# Altium project Controller.PrjPcb (part 1 of 2)
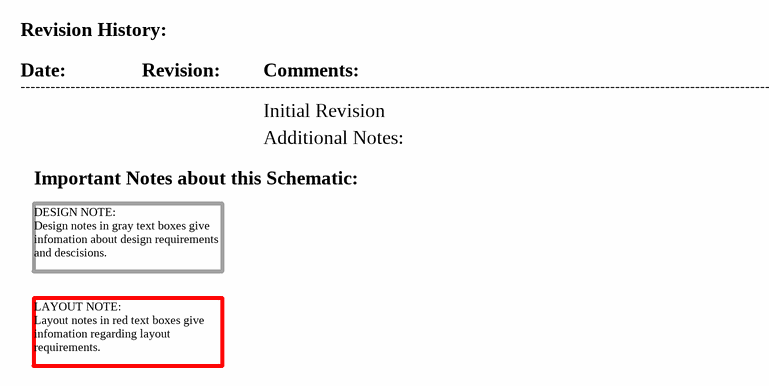
[diagram p0: 01-Revision_History_and_Contents.SchDoc]
8 sheets, 159 parts. Net scope: global (net labels, ports and power ports of the same name join across sheets).
Board file: Controller.PcbDoc
Sheets:
  01-Revision_History_and_Contents.SchDoc
  02_USB_Bridge.SchDoc
  03_Connectors.SchDoc
  04_PSoC6.SchDoc
  05_Mechanical.SchDoc
  06_Power.SchDoc
  07_Programming_Reset.SchDoc
  08_User_IO.SchDoc

## Sheet 01-Revision_History_and_Contents.SchDoc: Revision History and Table of Contents
size A; Revision: A; SheetNumber: 1; SheetTotal: 8; ECE315_Project_Name: ECE453 MCU Base Project

### Notes on the sheet
- Revision History:
- Date:
- ----------------------------------------------------------------------------------------------------------------------------------------------------------------------
- Revision:
- Comments:
- Initial Revision
- Important Notes about this Schematic:
- Additional Notes:
- DESIGN NOTE:
  Design notes in gray text boxes give infomation about design requirements and descisions.
- LAYOUT NOTE:
  Layout notes in red text boxes give infomation regarding layout requirements.
- Title:
- Size:
- A
- Project
- Rev:
- Sheet:
- of
- College of Engineering
- 1415 Engineering Drive
- Madison, WI 53706

## Sheet 02_USB_Bridge.SchDoc: USB Bridge
size A; Revision: A; SheetNumber: 2; SheetTotal: 8; ECE315_Project_Name: ECE453 MCU Base Project
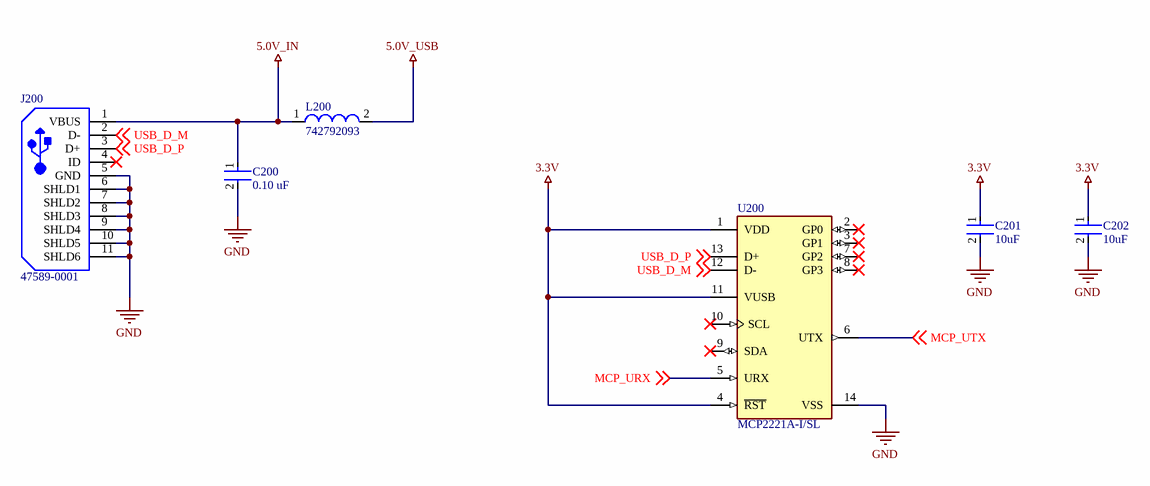
[diagram p1: 02_USB_Bridge.SchDoc]

### Parts
C200  0.10 uF  [FP-C0805C-DN-MFG]
C201  10uF  [FP-C0805C-DG-MFG]
C202  10uF  [FP-C0805C-DG-MFG]
J200  47589-0001  [MOLX-47589-0001_V]
L200  742792093  [SMD-0805]
U200  MCP2221A-I/SL  [FP-C04-065-SL-MFG]

### Nets
3.3V: C201.1 C202.1 U200.1(VDD) U200.4(~{RST}) U200.11(VUSB)
5.0V_IN: C200.1 J200.1(VBUS) L200.1
5.0V_USB: L200.2
GND: C200.2 C201.2 C202.2 J200.5(GND) J200.6(SHLD1) J200.7(SHLD2) J200.8(SHLD3) J200.9(SHLD4) J200.10(SHLD5) J200.11(SHLD6) U200.14(VSS)
MCP_URX: U200.5(URX) ; off-sheet MCP_URX
MCP_UTX: U200.6(UTX) ; off-sheet MCP_UTX
USB_D_M: J200.2(D-) U200.12(D-) ; off-sheet USB_D_M
USB_D_P: J200.3(D+) U200.13(D+) ; off-sheet USB_D_P

Not connected (* = marked no-connect by the designer): J200 4(ID)*; U200 2(GP0)* 3(GP1)* 7(GP2)* 8(GP3)* 9(SDA)* 10(SCL)*

### Notes on the sheet
- Title:
- Size:
- A
- Project
- Rev:
- Sheet:
- of
- College of Engineering
- 1415 Engineering Drive
- Madison, WI 53706

### Library data of the parts
C200 = CMP-2007-00279-2: CAP CER 0.1UF 50V X7R 0805; Manufacturer Part Number: C0805C104K5RACTU; Manufacturer: KEMET; Value: 0.10 μF; Tolerance: 0.1; Temperature Coefficient: 30ppm/°C; Material: Ceramic; Device Class L2: Capacitors; Temperature Range Low: -55°C; Voltage Rating: 50 V; Digikey Description: CAP CER 0.1UF 50V X7R 0805; Category: Cap; ComponentLink2Description: Datasheet; Octopart: https://octopart.com/c0805c104k5ractu-kemet-143926; RoHS: TRUE; ComponentLink2URL: https://content.kemet.com/datasheets/KEM_C1003_C0G_SMD.pdf; Temperature Characteristic: X7R; Temperature: -55°C to +125°C; Height: 0.88mm; Temperature Range High: +125°C; Device Class L1: Passive Components; Automotive: No; Lead Free: Yes; Ipc Land Pattern Name: CAPC200125X78; Device Class L3: Ceramic Capacitors; Mouser Description: Cap Ceramic 0.1uF 50V X7R 10% SMD 2.0 x 1.2 mm 125 C Paper T/R; Capacitance: 0.10 μF; Package: C0805C-DN
C201 C202 = CMP-2007-03243-2: CAP CER 10UF 10V X5R 0805; Manufacturer Part Number: C0805C106K8PACTU; Manufacturer: Kemet; 3DS Part Number: 220-00001; Tolerance: 10%; Temperature Coefficient: 15%; Material: Ceramic; Device Class L2: Capacitors; Device Class L1: Passive Components; ComponentLink2URL: https://content.kemet.com/datasheets/KEM_C1006_X5R_SMD.pdf; Height: 1.4mm; Lead Free: Yes; Digikey Description: CAP CER 10UF 10V X5R 0805; Octopart: https://octopart.com/c0805c106k8pactu-kemet-98697; Capacitance: 10uF; Value: 10uF; Temperature Range Low: -55°C; Temperature: -55°C to +85°C; Automotive: No; Mouser Description: CAP CER 10UF 10V X5R 0805; Ipc Land Pattern Name: CAPC200125X125; Temperature Range High: +85°C; Voltage: 10V; RoHS: TRUE; Device Class L3: Ceramic Capacitors; ComponentLink2Description: Datasheet; Voltage Rating: 10V; Package: C0805C-DG; Temperature Characteristic: X5R; Category: Cap
J200 = CMP-2000-05610-1: Right Angle Female Type AB Micro USB Connector, 30 V, 1.8 A, -30 to 85 degC, RoHS, Tape and Reel; Number of Ports: 1Port; Current Rating: 1.8A; Brand: Molex; Connector Type: MicroUSBTypeABreceptacle; Number of Contacts: 5Contact; Voltage Rating: 30VAC; Color: Black; Product: MicroUSBTypeABConnectors; Package URL: http://www.molex.com/pdm_docs/sd/475890001_sd.pdf; Contact Plating: Gold; Datasheet URL: http://www.molex.com/webdocs/datasheets/pdf/en-us/0475890001_IO_CONNECTORS.pdf; Operating Temperature Range: -20Cto+85C; Termination Style: SMD/SMT; Mounting Angle: Right; Package Reference: 47589-0001; Gender: Female; Package Description: Micro USB Connector, Pitch 0.65 mm, 5 Positions, Body 7.5 x 5.6 mm; Mounting Technology: SurfaceMount; Contact Material: CopperAlloy; Packaging: Reel; RoHS: True; Standard: USB; Manufacturer URL: http://www.molex.com/; Manufacturer: Molex; Datasheet Version: 12/2016; Product Category: USBConnectors; Series: 47589
L200 = CMP-0220-00169-1: SMD EMI Suppression Ferrite Bead WE-CBF, Z = 2200 Ohm; DatasheetVersion: Dec-2005; ComponentLink2URL: http://www.we-online.de/katalog/media/pdf/742792093.pdf; PackageDescription: Chip Inductor, 2-Leads, Body 2.0 x 1.2 mm; Impedance: 2200 Ohm; ComponentLink2Description: Datasheet; ComponentLink1Description: Manufacturer Link; PackageReference: SMD-0805; ComponentLink1URL: http://www.we-online.com; PackageVersion: 2005
U200 = CMP-06284-000011-1: IC USB TO I2C/UART 14SOIC; Manufacturer: Microchip; Min Supply Voltage: 3V; Usb Standard: USB 2.0; Max Supply Voltage: 5.5V; Nominal Supply Current: 10-13mA; Automotive Grade: Grade 3; Interface: I2C,UART,USB; Standoff Height: 0.1mm; Max Junction Temp: +150°C; Data Rate: 12Mbits/s; Lead Free: Yes; Height: 1.75mm; Octopart: https://octopart.com/mcp2221a-i%2Fsl-microchip-71704986; Package: C04-065-SL; Digikey Description: IC USB TO I2C/UART 14SOIC; Temperature Range Low: -40°C; Temperature: -40°C to +85°C; Category: IC; Temperature Range High: +85°C; Ambient Temperature Range Low: -40°C; Device Class L1: Integrated Circuits (ICs); Footprint Url: http://ww1.microchip.com/downloads/en/DeviceDoc/14L%20SOIC%203_90%20mm%20%28SL%29%20C04-00065d.pdf; Automotive: Yes; ComponentLink2URL: http://ww1.microchip.com/downloads/en/DeviceDoc/20005565B.pdf; Ambient Temperature Range High: +85°C; RoHS: TRUE; Device Class L3: USB Interface ICs; ComponentLink2Description: Datasheet; Device Class L2: Interface ICs; Manufacturer Part Number: MCP2221A-I/SL; Ipc Land Pattern Name: SOIC127P600X175-14

## Sheet 03_Connectors.SchDoc: Off Board Connectors
size A; Revision: A; SheetNumber: 3; SheetTotal: 8; ECE315_Project_Name: ECE453 MCU Base Project
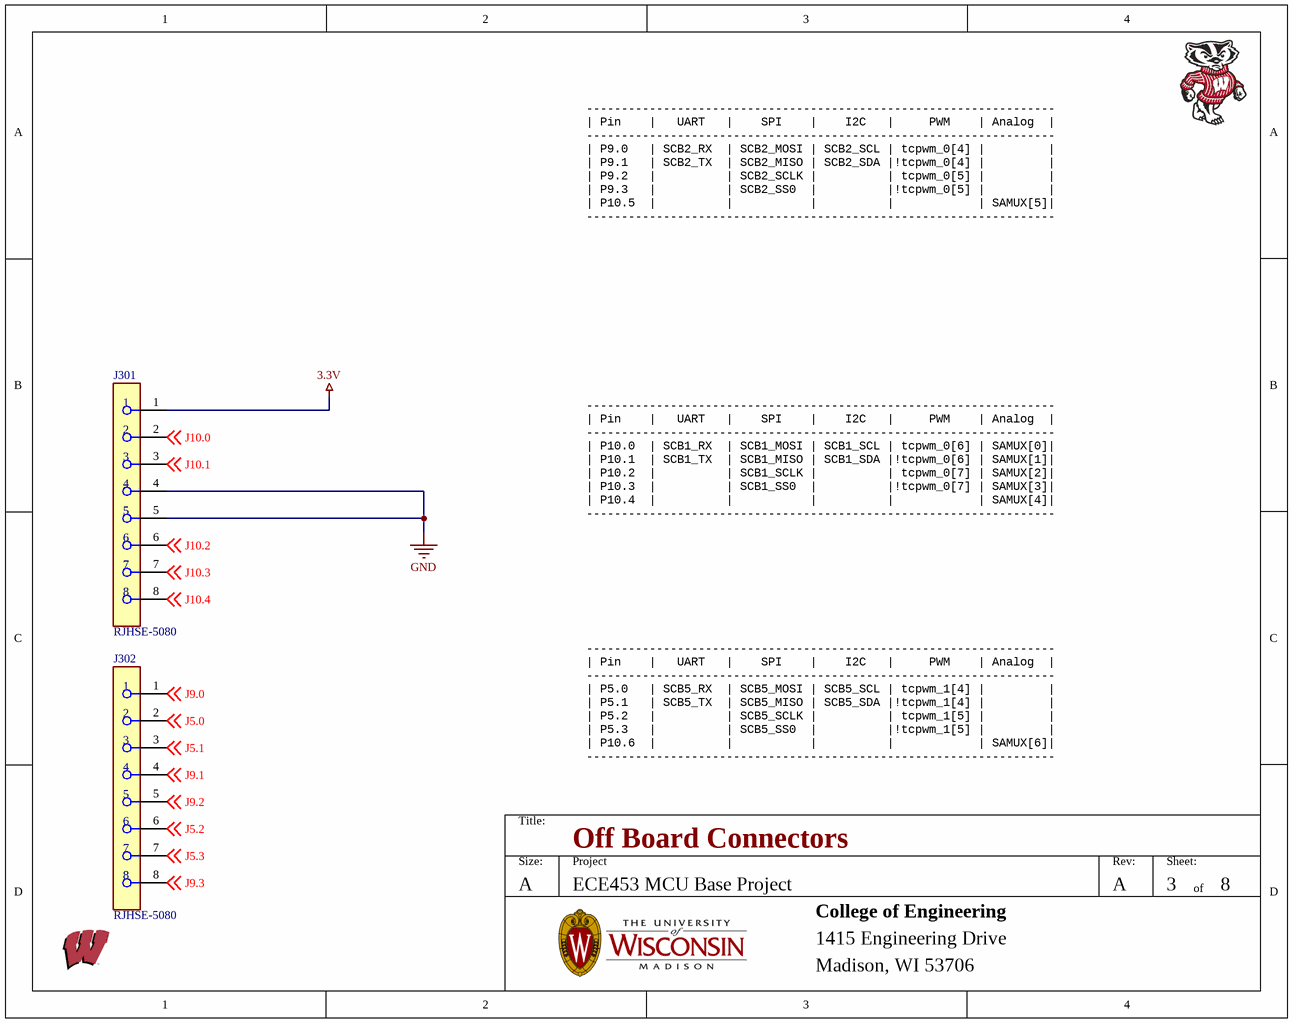
[diagram p2: 03_Connectors.SchDoc]

### Parts
J301  RJHSE-5080  [FP-RJHSE-5080-MFG]
J302  RJHSE-5080  [FP-RJHSE-5080-MFG]

### Nets
3.3V: J301.1
GND: J301.4 J301.5
J5.0: J302.2 ; off-sheet J5.0
J5.1: J302.3 ; off-sheet J5.1
J5.2: J302.6 ; off-sheet J5.2
J5.3: J302.7 ; off-sheet J5.3
J9.0: J302.1 ; off-sheet J9.0
J9.1: J302.4 ; off-sheet J9.1
J9.2: J302.5 ; off-sheet J9.2
J9.3: J302.8 ; off-sheet J9.3
J10.0: J301.2 ; off-sheet J10.0
J10.1: J301.3 ; off-sheet J10.1
J10.2: J301.6 ; off-sheet J10.2
J10.3: J301.7 ; off-sheet J10.3
J10.4: J301.8 ; off-sheet J10.4

### Notes on the sheet
- -------------------------------------------------------------------
  | Pin    |   UART   |    SPI    |    I2C   |     PWM    | Analog  |
  -------------------------------------------------------------------
  | P9.0   | SCB2_RX  | SCB2_MOSI | SCB2_SCL | tcpwm_0[4] |         |
  | P9.1   | SCB2_TX  | SCB2_MISO | SCB2_SDA |!tcpwm_0[4] |         |
  | P9.2   |          | SCB2_SCLK |          | tcpwm_0[5] |         |
  | P9.3   |          | SCB2_SS0  |          |!tcpwm_0[5] |         |
  | P10.5  |          |           |          |            | SAMUX[5]|
  -------------------------------------------------------------------
- -------------------------------------------------------------------
  | Pin    |   UART   |    SPI    |    I2C   |     PWM    | Analog  |
  -------------------------------------------------------------------
  | P10.0  | SCB1_RX  | SCB1_MOSI | SCB1_SCL | tcpwm_0[6] | SAMUX[0]|
  | P10.1  | SCB1_TX  | SCB1_MISO | SCB1_SDA |!tcpwm_0[6] | SAMUX[1]|
  | P10.2  |          | SCB1_SCLK |          | tcpwm_0[7] | SAMUX[2]|
  | P10.3  |          | SCB1_SS0  |          |!tcpwm_0[7] | SAMUX[3]|
  | P10.4  |          |           |          |            | SAMUX[4]|
  -------------------------------------------------------------------
- -------------------------------------------------------------------
  | Pin    |   UART   |    SPI    |    I2C   |     PWM    | Analog  |
  -------------------------------------------------------------------
  | P5.0   | SCB5_RX  | SCB5_MOSI | SCB5_SCL | tcpwm_1[4] |         |
  | P5.1   | SCB5_TX  | SCB5_MISO | SCB5_SDA |!tcpwm_1[4] |         |
  | P5.2   |          | SCB5_SCLK |          | tcpwm_1[5] |         |
  | P5.3   |          | SCB5_SS0  |          |!tcpwm_1[5] |         |
  | P10.6  |          |           |          |            | SAMUX[6]|
  -------------------------------------------------------------------
- Title:
- Size:
- A
- Project
- Rev:
- Sheet:
- of
- College of Engineering
- 1415 Engineering Drive
- Madison, WI 53706

### Library data of the parts
J301 J302 = CMP-02366-000003-1: CONN MOD JACK 8P8C R/A UNSHLD; Manufacturer: Amphenol; Current Rating: 1.5A; Voltage Rating: 125V; Pitch: 1.02mm; Conn Orientation: Right Angle; Number Of Contacts: 8; Is Female: yes; Conn Gender: Female; Contact Resistance: 20mR; Number of Ports: 1; Connector Type: RJ45; Lead Free: Yes; Device Class L3: unset; Footprint Url: https://cdn.amphenol-icc.com/media/wysiwyg/files/drawing/rjhse5080.pdf?__cf_chl_jschl_tk__=e349db0bbbb6188a39347cd5e541b92fa02c9719-1587748343-0-AW7tChdeHzRPLX9gSWj7WrKaXQoY9BsmT9Ek0h-T62M9y3Rs9iypFcOtkzb-6sGYQEjFE-jcoNciDETCOZrh1rYyOesac5SvYLoLwHIsHvF4AKBlx-MXmfZUVk9OTTJLqyQq2qMm0PFRLJpNcK0nrKResqOniRSYixG2sPTmOPraH-ULJFBDL602CHqcI9KKBgTq90Jh1OL2Td4moJ99rFsJRJ1Tk_uoxGe8ublcP_ARu-uLpWcQrBcwOcHDTAwL29DAwVaqcH7ta8Ks7WMlHmVl_pILeEDwT0bE9vu5Pa5S3PtNRF1leuFkgi_FMbUxTDulc5xzbXSfng8srUIV1lWXny5nx1fZJEUa_w97yKjffzBMxiWLWVN-V7-uqAaPbyv_m-wRyw5O25OZNyJOeGU; ComponentLink2URL: https://cdn.amphenol-icc.com/media/wysiwyg/files/documentation/datasheet/inputoutput/io-modjack-rjhse.pdf; Device Class L1: Connectors; Package: CONN_MOD_JACK; Mouser Description: Modular Connectors / Ethernet Connectors R/A RJ45 NONSHIELDED 8 CONT NO LEDS; Manufacturer Part Number: RJHSE-5080; Octopart: https://octopart.com/rjhse-5080-amphenol-45060; Category: Conn; Height: 0.535inch; Temperature: -55°C to +85°C; Digikey Description: CONN MOD JACK 8P8C R/A UNSHLD; Device Class L2: Modular / Ethernet Connectors; Contact Material: Gold,Nickel; ComponentLink2Description: Datasheet; Temperature Range Low: -55°C; RoHS: TRUE; Automotive: No; Temperature Range High: +85°C; Supplier: Digikey; Supplier Part Number: RJHSE-5080-ND; Stock: 72112; Pricing: 1=1.03, 10=0.867, 25=0.832, 50=0.8142, 100=0.7788, 250=0.708, 500=0.6372, 1000=0.56641, 2500=0.51331 (USD); Mounting Technology: Through Hole,Panel; Contact Plating: Gold; Max Current Rating: 1.5A; Number of Positions Loaded: 8; Max Voltage Rating (AC): 125V; Orientation: Right Angle; Packaging: Rail/Tube; Gender: Female; Termination: Solder; Number of Positions: 8; Voltage Rating (DC): 125V; Length: 15.75mm; Depth: 14.99mm; Radiation Hardening: No; RoHS Compliant: Yes; Reach SVHC Compliant: Unknown; ComponentLink1URL: https://datasheet.ciiva.com/7629/1682821-7629402.pdf?src-supplier=Element14; ComponentLink1Description: https://datasheet.ciiva.com/7629/1682821-7629402.pdf?src-supplier=Element14; ComponentLink3URL: https://datasheet.ciiva.com/1432/1693748-1432448.pdf?src-supplier=Element14; ComponentLink3Description: https://datasheet.ciiva.com/1432/1693748-1432448.pdf?src-supplier=Element14

## Sheet 04_PSoC6.SchDoc: PSoC6
size A; Revision: A; SheetNumber: 4; SheetTotal: 8; ECE315_Project_Name: ECE453 MCU Base Project
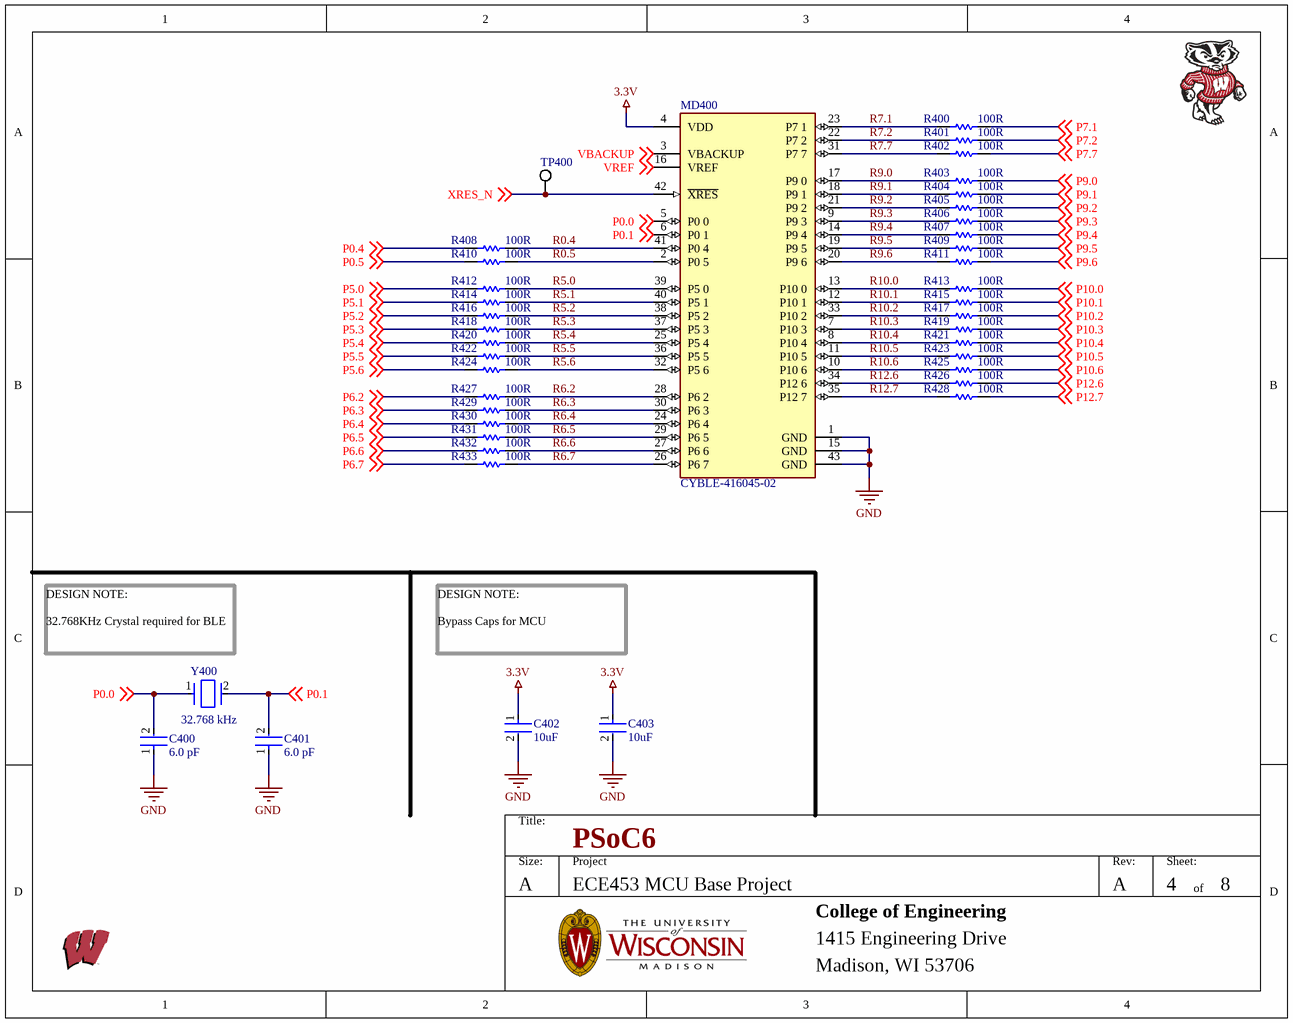
[diagram p3: 04_PSoC6.SchDoc]

### Parts
C400  6.0 pF  [FP-CBR08C-MFG]
C401  6.0 pF  [FP-CBR08C-MFG]
C402  10uF  [FP-C0805C-DG-MFG]
C403  10uF  [FP-C0805C-DG-MFG]
MD400  CYBLE-416045-02  [FP-CYBLE-416045-02-MFG]
R400  100R  [RESC2013X60X40ML20T25]
R401  100R  [RESC2013X60X40ML20T25]
R402  100R  [RESC2013X60X40ML20T25]
R403  100R  [RESC2013X60X40ML20T25]
R404  100R  [RESC2013X60X40ML20T25]
R405  100R  [RESC2013X60X40ML20T25]
R406  100R  [RESC2013X60X40ML20T25]
R407  100R  [RESC2013X60X40ML20T25]
R408  100R  [RESC2013X60X40ML20T25]
R409  100R  [RESC2013X60X40ML20T25]
R410  100R  [RESC2013X60X40ML20T25]
R411  100R  [RESC2013X60X40ML20T25]
R412  100R  [RESC2013X60X40ML20T25]
R413  100R  [RESC2013X60X40ML20T25]
R414  100R  [RESC2013X60X40ML20T25]
R415  100R  [RESC2013X60X40ML20T25]
R416  100R  [RESC2013X60X40ML20T25]
R417  100R  [RESC2013X60X40ML20T25]
R418  100R  [RESC2013X60X40ML20T25]
R419  100R  [RESC2013X60X40ML20T25]
R420  100R  [RESC2013X60X40ML20T25]
R421  100R  [RESC2013X60X40ML20T25]
R422  100R  [RESC2013X60X40ML20T25]
R423  100R  [RESC2013X60X40ML20T25]
R424  100R  [RESC2013X60X40ML20T25]
R425  100R  [RESC2013X60X40ML20T25]
R426  100R  [RESC2013X60X40ML20T25]
R427  100R  [RESC2013X60X40ML20T25]
R428  100R  [RESC2013X60X40ML20T25]
R429  100R  [RESC2013X60X40ML20T25]
R430  100R  [RESC2013X60X40ML20T25]
R431  100R  [RESC2013X60X40ML20T25]
R432  100R  [RESC2013X60X40ML20T25]
R433  100R  [RESC2013X60X40ML20T25]
TP400  (no value)  [KSTN-5019_V]
Y400  32.768 kHz  [FP-ABS07-120-MFG]

### Nets
3.3V: C402.1 C403.1 MD400.4(VDD)
GND: C400.1 C401.1 C402.2 C403.2 MD400.1(GND) MD400.15(GND) MD400.43(GND)
P0.0: C400.2 MD400.5(P0_0) Y400.1 ; off-sheet P0.0
P0.1: C401.2 MD400.6(P0_1) Y400.2 ; off-sheet P0.1
P0.4: R408.1 ; off-sheet P0.4
P0.5: R410.1 ; off-sheet P0.5
P5.0: R412.1 ; off-sheet P5.0
P5.1: R414.1 ; off-sheet P5.1
P5.2: R416.1 ; off-sheet P5.2
P5.3: R418.1 ; off-sheet P5.3
P5.4: R420.1 ; off-sheet P5.4
P5.5: R422.1 ; off-sheet P5.5
P5.6: R424.1 ; off-sheet P5.6
P6.2: R427.1 ; off-sheet P6.2
P6.3: R429.1 ; off-sheet P6.3
P6.4: R430.1 ; off-sheet P6.4
P6.5: R431.1 ; off-sheet P6.5
P6.6: R432.1 ; off-sheet P6.6
P6.7: R433.1 ; off-sheet P6.7
P7.1: R400.2 ; off-sheet P7.1
P7.2: R401.2 ; off-sheet P7.2
P7.7: R402.2 ; off-sheet P7.7
P9.0: R403.2 ; off-sheet P9.0
P9.1: R404.2 ; off-sheet P9.1
P9.2: R405.2 ; off-sheet P9.2
P9.3: R406.2 ; off-sheet P9.3
P9.4: R407.2 ; off-sheet P9.4
P9.5: R409.2 ; off-sheet P9.5
P9.6: R411.2 ; off-sheet P9.6
P10.0: R413.2 ; off-sheet P10.0
P10.1: R415.2 ; off-sheet P10.1
P10.2: R417.2 ; off-sheet P10.2
P10.3: R419.2 ; off-sheet P10.3
P10.4: R421.2 ; off-sheet P10.4
P10.5: R423.2 ; off-sheet P10.5
P10.6: R425.2 ; off-sheet P10.6
P12.6: R426.2 ; off-sheet P12.6
P12.7: R428.2 ; off-sheet P12.7
R0.4: MD400.41(P0_4) R408.2
R0.5: MD400.2(P0_5) R410.2
R5.0: MD400.39(P5_0) R412.2
R5.1: MD400.40(P5_1) R414.2
R5.2: MD400.38(P5_2) R416.2
R5.3: MD400.37(P5_3) R418.2
R5.4: MD400.25(P5_4) R420.2
R5.5: MD400.36(P5_5) R422.2
R5.6: MD400.32(P5_6) R424.2
R6.2: MD400.28(P6_2) R427.2
R6.3: MD400.30(P6_3) R429.2
R6.4: MD400.24(P6_4) R430.2
R6.5: MD400.29(P6_5) R431.2
R6.6: MD400.27(P6_6) R432.2
R6.7: MD400.26(P6_7) R433.2
R7.1: MD400.23(P7_1) R400.1
R7.2: MD400.22(P7_2) R401.1
R7.7: MD400.31(P7_7) R402.1
R9.0: MD400.17(P9_0) R403.1
R9.1: MD400.18(P9_1) R404.1
R9.2: MD400.21(P9_2) R405.1
R9.3: MD400.9(P9_3) R406.1
R9.4: MD400.14(P9_4) R407.1
R9.5: MD400.19(P9_5) R409.1
R9.6: MD400.20(P9_6) R411.1
R10.0: MD400.13(P10_0) R413.1
R10.1: MD400.12(P10_1) R415.1
R10.2: MD400.33(P10_2) R417.1
R10.3: MD400.7(P10_3) R419.1
R10.4: MD400.8(P10_4) R421.1
R10.5: MD400.11(P10_5) R423.1
R10.6: MD400.10(P10_6) R425.1
R12.6: MD400.34(P12_6) R426.1
R12.7: MD400.35(P12_7) R428.1
VBACKUP: MD400.3(VBACKUP) ; off-sheet VBACKUP
VREF: MD400.16(VREF) ; off-sheet VREF
XRES_N: MD400.42(~{XRES}) TP400.1 ; off-sheet XRES_N

### Notes on the sheet
- (near Y400) DESIGN NOTE:
  32.768KHz Crystal required for BLE
- DESIGN NOTE:
  Bypass Caps for MCU
- Title:
- Size:
- A
- Project
- Rev:
- Sheet:
- of
- College of Engineering
- 1415 Engineering Drive
- Madison, WI 53706

### Library data of the parts
C400 C401 = CMP-03020-018446-1: CAP CER 6PF 250V C0G/NP0 0805; Manufacturer Part Number: CBR08C609CAGAC; Manufacturer: KEMET; Temperature Characteristic: C0G; Tolerance: 0.25 pF; Material: Ceramic; Temperature Coefficient: 30ppm/°C; Lead Free: Yes; Category: Cap; Device Class L3: Ceramic Capacitors; Temperature: -55°C to +125°C; Height: 0.95mm; Package: CBR08C; Temperature Range Low: -55°C; Device Class L1: Passive Components; ComponentLink2Description: Datasheet; ComponentLink2URL: https://content.kemet.com/datasheets/KEM_C1030_CBR_SMD.pdf; Digikey Description: CAP CER 6PF 250V C0G/NP0 0805; Ipc Land Pattern Name: CAPC200125X85; Octopart: https://octopart.com/cbr08c609cagac-kemet-23841672; Device Class L2: Capacitors; Temperature Range High: +125°C; Voltage Rating: 250 V; RoHS: TRUE; Capacitance: 6.0 pF; Mouser Description: Multilayer Ceramic Capacitors MLCC - SMD/SMT 250volts 6pF C0G 0805 .25pF Tol RF; Value: 6.0 pF; Automotive: No
C402 C403 = CMP-2007-03243-2: as C201 on sheet 02_USB_Bridge; Device Class L2: Capacitors; Device Class L1: Passive Components; ComponentLink2URL: https://content.kemet.com/datasheets/KEM_C1006_X5R_SMD.pdf; Height: 1.4mm; Lead Free: Yes; Digikey Description: CAP CER 10UF 10V X5R 0805; Octopart: https://octopart.com/c0805c106k8pactu-kemet-98697; Capacitance: 10uF; Value: 10uF; Temperature Range Low: -55°C; Temperature: -55°C to +85°C; Automotive: No; Mouser Description: CAP CER 10UF 10V X5R 0805; Ipc Land Pattern Name: CAPC200125X125; Temperature Range High: +85°C; Voltage: 10V; RoHS: TRUE; Device Class L3: Ceramic Capacitors; ComponentLink2Description: Datasheet; Voltage Rating: 10V; Package: C0805C-DG; Temperature Characteristic: X5R; Category: Cap
MD400 = CMP-12964-000002-1: RF TXRX MOD BLUETOOTH TRACE ANT; Manufacturer: Cypress Semiconductor; Number Of Gpio: 36; Number Of Adc Channels: 1; Max Supply Voltage: 3.6V; Min Supply Voltage: 1.71V; Data Rate: 2Mbits/s; Receiving Current: 6.7mA; Max Frequency: 2.5GHz; Bandwidth: 100MHz; Transmitting Current: 5.7mA; Interface: I2C,SPI,UART,I2S,Other; Octopart: https://octopart.com/cyble-416045-02-cypress+semiconductor-96386825; Lead Free: Yes; RoHS: TRUE; Device Class L3: Transceivers; Category: UNK; Package: 0; Device Class L2: RF Semiconductors and Devices; Automotive: No; ComponentLink2URL: https://www.cypress.com/file/428336/download; Temperature Range Low: -40°C; Height: 2mm; Device Class L1: Integrated Circuits (ICs); Manufacturer Part Number: CYBLE-416045-02; ComponentLink2Description: Datasheet; Digikey Description: RF TXRX MOD BLUETOOTH TRACE ANT; Temperature: -40°C to +85°C; Temperature Range High: +85°C
R400-R433 = CMP-2001-00580-1: Manufacturer: Panasonic; Part Number: ERA6AEB101V
TP400 = CMP-1672-00008-1: Test Point, 1 Position SMD, RoHS, Tape and Reel; ComponentLink1Description: Manufacturer URL; Package Quantity: 1000; DatasheetVersion: 03/2014; Packaging: Tape and Reel; ComponentLink2URL: http://www.keyelco.com/product-pdf.cfm?p=1357; ComponentLink1URL: http://www.keyelco.com/; Mount: Surface Mount; Contact Plating: Silver; PackageDescription: 1-Pin Surface Mount Device, Body 3.81 x 2.03 mm; Pins: 1; RoHSCompliant: True; Mounting Technology: Surface Mount; ComponentLink2Description: Datasheet; PackageReference: 5019
Y400 = CMP-2000-07587-2: CRYSTAL 32.7680KHZ 6PF SMD; Frequency Tolerance: 20ppm; Series Resistance: 60kR; ESR (Equivalent Series Resistance): 55kR; Depth: 1.5mm; Width: 0.061inch; Number of Pins: 2; Max Operating Temperature: 85°C; Length: 3.2mm; Case/Package: SMD/SMT; Series: ABS07; Lead Free: Lead Free; Min Operating Temperature: -40°C; Load Capacitance: 6pF; Packaging: Tape and Reel; Height: 0.035inch; Radiation Hardening: No; Tolerance: 20ppm; Operating Frequency: 32.768 kHz; Termination: SMD/SMT; REACH SVHC: No SVHC; RoHS Compliant: Yes; Frequency: 32.768kHz; Package Quantity: 3000; Mount: Surface Mount

## Sheet 05_Mechanical.SchDoc: Mechanicals
size A; Revision: A; SheetNumber: 5; SheetTotal: 8; ECE315_Project_Name: ECE453 MCU Base Project
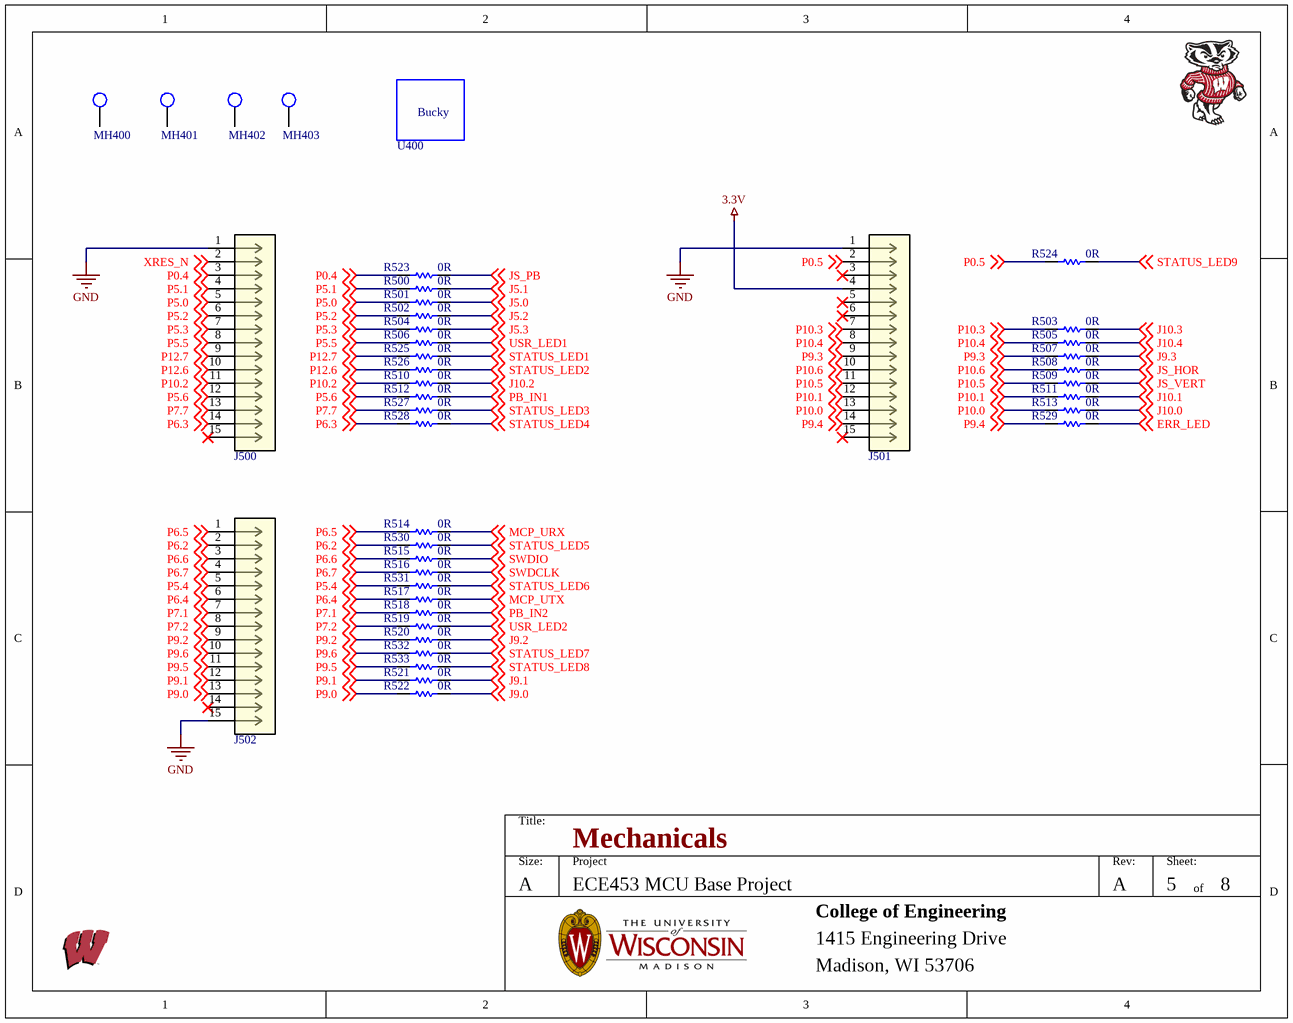
[diagram p4: 05_Mechanical.SchDoc]

### Parts
J500  68000-115HLF  [CONN_15POS_2P54MM]  (value not drawn)
J501  68000-115HLF  [CONN_15POS_2P54MM]  (value not drawn)
J502  68000-115HLF  [CONN_15POS_2P54MM]  (value not drawn)
MH400  MHOLE_2_55MM  [MHOLE_2_55MM]  (value not drawn)
MH401  MHOLE_2_55MM  [MHOLE_2_55MM]  (value not drawn)
MH402  MHOLE_2_55MM  [MHOLE_2_55MM]  (value not drawn)
MH403  MHOLE_2_55MM  [MHOLE_2_55MM]  (value not drawn)
R500  0R  [RESC2013X70X40NL20T20]
R501  0R  [RESC2013X70X40NL20T20]
R502  0R  [RESC2013X70X40NL20T20]
R503  0R  [RESC2013X70X40NL20T20]
R504  0R  [RESC2013X70X40NL20T20]
R505  0R  [RESC2013X70X40NL20T20]
R506  0R  [RESC2013X70X40NL20T20]
R507  0R  [RESC2013X70X40NL20T20]
R508  0R  [RESC2013X70X40NL20T20]
R509  0R  [RESC2013X70X40NL20T20]
R510  0R  [RESC2013X70X40NL20T20]
R511  0R  [RESC2013X70X40NL20T20]
R512  0R  [RESC2013X70X40NL20T20]
R513  0R  [RESC2013X70X40NL20T20]
R514  0R  [RESC2013X70X40NL20T20]
R515  0R  [RESC2013X70X40NL20T20]
R516  0R  [RESC2013X70X40NL20T20]
R517  0R  [RESC2013X70X40NL20T20]
R518  0R  [RESC2013X70X40NL20T20]
R519  0R  [RESC2013X70X40NL20T20]
R520  0R  [RESC2013X70X40NL20T20]
R521  0R  [RESC2013X70X40NL20T20]
R522  0R  [RESC2013X70X40NL20T20]
R523  0R  [RESC2013X70X40NL20T20]
R524  0R  [RESC2013X70X40NL20T20]
R525  0R  [RESC2013X70X40NL20T20]
R526  0R  [RESC2013X70X40NL20T20]
R527  0R  [RESC2013X70X40NL20T20]
R528  0R  [RESC2013X70X40NL20T20]
R529  0R  [RESC2013X70X40NL20T20]
R530  0R  [RESC2013X70X40NL20T20]
R531  0R  [RESC2013X70X40NL20T20]
R532  0R  [RESC2013X70X40NL20T20]
R533  0R  [RESC2013X70X40NL20T20]
U400  Bucky  [WalkingBucky]  (value not drawn)  (no BOM)

### Nets
3.3V: J501.4
GND: J500.1 J501.1 J502.15
ERR_LED: R529.2 ; off-sheet ERR_LED
J5.0: R501.2 ; off-sheet J5.0
J5.1: R500.2 ; off-sheet J5.1
J5.2: R502.2 ; off-sheet J5.2
J5.3: R504.2 ; off-sheet J5.3
J9.0: R522.2 ; off-sheet J9.0
J9.1: R521.2 ; off-sheet J9.1
J9.2: R520.2 ; off-sheet J9.2
J9.3: R507.2 ; off-sheet J9.3
J10.0: R513.2 ; off-sheet J10.0
J10.1: R511.2 ; off-sheet J10.1
J10.2: R510.2 ; off-sheet J10.2
J10.3: R503.2 ; off-sheet J10.3
J10.4: R505.2 ; off-sheet J10.4
JS_HOR: R508.2 ; off-sheet JS_HOR
JS_PB: R523.2 ; off-sheet JS_PB
JS_VERT: R509.2 ; off-sheet JS_VERT
MCP_URX: R514.2 ; off-sheet MCP_URX
MCP_UTX: R517.2 ; off-sheet MCP_UTX
P0.4: J500.3 R523.1 ; off-sheet P0.4
P0.5: J501.2 R524.1 ; off-sheet P0.5
P5.0: J500.5 R501.1 ; off-sheet P5.0
P5.1: J500.4 R500.1 ; off-sheet P5.1
P5.2: J500.6 R502.1 ; off-sheet P5.2
P5.3: J500.7 R504.1 ; off-sheet P5.3
P5.4: J502.5 R531.1 ; off-sheet P5.4
P5.5: J500.8 R506.1 ; off-sheet P5.5
P5.6: J500.12 R512.1 ; off-sheet P5.6
P6.2: J502.2 R530.1 ; off-sheet P6.2
P6.3: J500.14 R528.1 ; off-sheet P6.3
P6.4: J502.6 R517.1 ; off-sheet P6.4
P6.5: J502.1 R514.1 ; off-sheet P6.5
P6.6: J502.3 R515.1 ; off-sheet P6.6
P6.7: J502.4 R516.1 ; off-sheet P6.7
P7.1: J502.7 R518.1 ; off-sheet P7.1
P7.2: J502.8 R519.1 ; off-sheet P7.2
P7.7: J500.13 R527.1 ; off-sheet P7.7
P9.0: J502.13 R522.1 ; off-sheet P9.0
P9.1: J502.12 R521.1 ; off-sheet P9.1
P9.2: J502.9 R520.1 ; off-sheet P9.2
P9.3: J501.9 R507.1 ; off-sheet P9.3
P9.4: J501.14 R529.1 ; off-sheet P9.4
P9.5: J502.11 R533.1 ; off-sheet P9.5
P9.6: J502.10 R532.1 ; off-sheet P9.6
P10.0: J501.13 R513.1 ; off-sheet P10.0
P10.1: J501.12 R511.1 ; off-sheet P10.1
P10.2: J500.11 R510.1 ; off-sheet P10.2
P10.3: J501.7 R503.1 ; off-sheet P10.3
P10.4: J501.8 R505.1 ; off-sheet P10.4
P10.5: J501.11 R509.1 ; off-sheet P10.5
P10.6: J501.10 R508.1 ; off-sheet P10.6
P12.6: J500.10 R526.1 ; off-sheet P12.6
P12.7: J500.9 R525.1 ; off-sheet P12.7
PB_IN1: R512.2 ; off-sheet PB_IN1
PB_IN2: R518.2 ; off-sheet PB_IN2
STATUS_LED1: R525.2 ; off-sheet STATUS_LED1
STATUS_LED2: R526.2 ; off-sheet STATUS_LED2
STATUS_LED3: R527.2 ; off-sheet STATUS_LED3
STATUS_LED4: R528.2 ; off-sheet STATUS_LED4
STATUS_LED5: R530.2 ; off-sheet STATUS_LED5
STATUS_LED6: R531.2 ; off-sheet STATUS_LED6
STATUS_LED7: R532.2 ; off-sheet STATUS_LED7
STATUS_LED8: R533.2 ; off-sheet STATUS_LED8
STATUS_LED9: R524.2 ; off-sheet STATUS_LED9
SWDCLK: R516.2 ; off-sheet SWDCLK
SWDIO: R515.2 ; off-sheet SWDIO
USR_LED1: R506.2 ; off-sheet USR_LED1
USR_LED2: R519.2 ; off-sheet USR_LED2
XRES_N: J500.2 ; off-sheet XRES_N

Not connected (* = marked no-connect by the designer): J500 15*; J501 3* 5* 6* 15*; J502 14*; MH400 1; MH401 1; MH402 1; MH403 1

### Notes on the sheet
- Title:
- Size:
- A
- Project
- Rev:
- Sheet:
- of
- College of Engineering
- 1415 Engineering Drive
- Madison, WI 53706

### Library data of the parts
J500-J502 = CONN_HEADER_POS_30_2.54MM: Conn Unshrouded Header HDR 15 POS 2.54mm Solder ST Thru-Hole; Mfr_Name: Amphenol ICC; Manufacturer: Adam Equipment; Manufacturer Part Number: PH1-15-UA; Copyright: Copyright (C) 2024 Ultra Librarian. All rights reserved.; Manufacturer_Part_Number: 68000-115HLF; RefDes: RefDes; Type: DEV; Supplier: Digikey; Supplier Part Number: 2057-PH1-15-UA-ND; RoHS: No; Category: Connectors; Stock: 2835; Pricing: 1=0.18, 10=0.15, 100=0.1157, 500=0.09788, 1000=0.08008, 5000=0.07118, 10000=0.06451 (USD)
MH400-MH403 = MHOLE_2_55MM: Mounting Holde; Manufacturer Part Number: UW MTHOLE
R500-R533 = CMP-1665-00002-5: Chip Resistor, 0 Ohm, +/- 1%, 0.125 W, -55 to 155 degC, 0805 (2012 Metric), RoHS, Tape and Reel; PartNumber: ERJ-6GEY0R00V; Tolerance: 5%; Resistance: 0 Ohm; REACH SVHC: No SVHC; Min Operating Temperature: -55 degC; Case/Package: 0805; Packaging: Tape and Reel; Package Quantity: 5000; ComponentLink1Description: Manufacturer URL; PackageDescription: 2-Pin Surface Mount Device, Body 2 x 1.25 mm; Mounting Technology: Surface Mount; Max Operating Temperature: 155 degC; Width: 1.25 mm; RoHSCompliant: True; Height: 0.6 mm; ComponentLink1URL: http://www.panasonic.com/; ComponentLink2URL: http://industrial.panasonic.com/cdbs/www-data/pdf/RDA0000/AOA0000C84.pdf; Case Code (Imperial): 0805; DatasheetVersion: 03/2015; Length: 2 mm; Case Code (Metric): 2012; ComponentLink2Description: Datasheet; Radiation Hardening: No
U400 = Bucky: Bucky Badger Image; Manufacturer Part Number: UW Bucky

## Sheet 06_Power.SchDoc: Power
size A; Revision: A; SheetNumber: 6; SheetTotal: 8; ECE315_Project_Name: ECE453 MCU Base Project
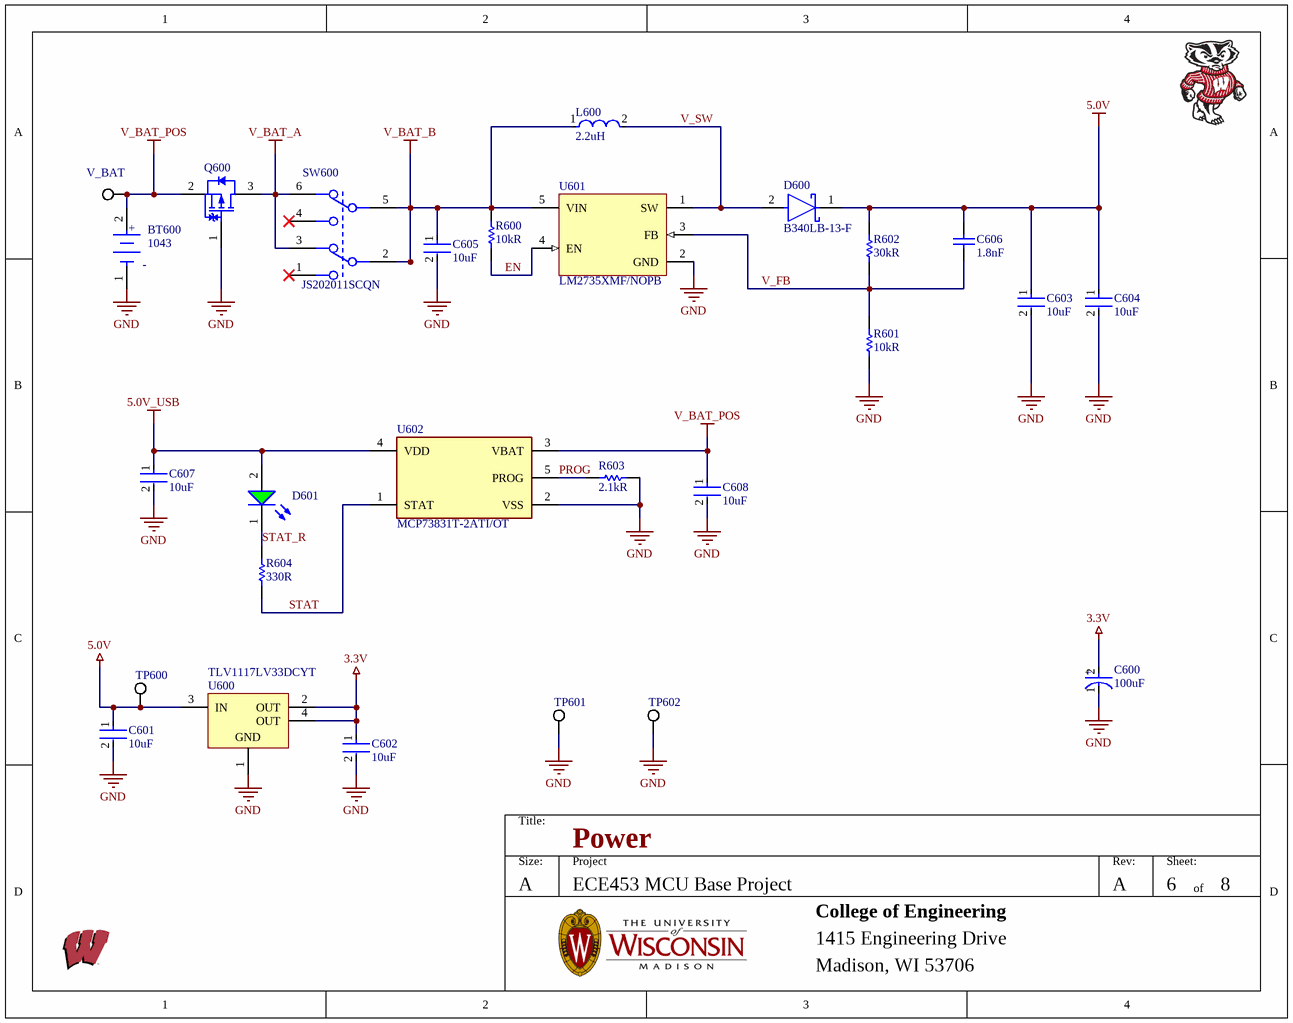
[diagram p5: 06_Power.SchDoc]

### Parts
BT600  1043  [BAT_1043]
C600  100uF  [FP-SD8-MFG]
C601  10uF  [FP-C0805C-DG-MFG]
C602  10uF  [FP-C0805C-DG-MFG]
C603  10uF  [FP-C0805C-DG-MFG]
C604  10uF  [FP-C0805C-DG-MFG]
C605  10uF  [FP-C0805C-DG-MFG]
C606  1.8nF  [CAPC2013X70X45LL10T25]
C607  10uF  [FP-C0805C-DG-MFG]
C608  10uF  [FP-C0805C-DG-MFG]
D600  B340LB-13-F  [FP-SMB-MFG]
D601  (no value)  [WL-SMCW_0805_150080xx75000]
L600  2.2uH  [FP-NR4018-MFG]
Q600  (no value)  [TOSH-SOT-23F_V]
R600  10kR  [RESC2013X60X35NL10T20]
R601  10kR  [RESC2013X60X35NL10T20]
R602  30kR  [RESC2013X70X40LL20T20]
R603  2.1kR  [RESC2013X70X40ML20T20]
R604  330R  [RESC2013X60X40LL20T25]
SW600  JS202011SCQN  [FP-JS202011SCQN-MFG]
TP600  (no value)  [KSTN-5019_V]
TP601  (no value)  [KSTN-5019_V]
TP602  (no value)  [KSTN-5019_V]
U600  TLV1117LV33DCYT  [DCY0004A_M]
U601  LM2735XMF/NOPB  [DBV0005A_N]
U602  MCP73831T-2ATI/OT  [FP-C04-091-OT-IPC_C]
V_BAT  (no value)  [KSTN-5019_V]

### Nets
3.3V: C600.2(A) C602.1 U600.2(OUT) U600.4(OUT)
5.0V: C601.1 C603.1 C604.1 C606.2 D600.1(C) R602.2 TP600.1 U600.3(IN)
5.0V_USB: C607.1 D601.2(A) U602.4(VDD)
GND: BT600.1(C) C600.1(C) C601.2 C602.2 C603.2 C604.2 C605.2 C607.2 C608.2 Q600.1(G) R601.1 R603.2 TP601.1 TP602.1 U600.1(GND) U601.2(GND) U602.2(VSS)
V_BAT_A: Q600.3(D) SW600.3 SW600.6
V_BAT_B: C605.1 L600.1 R600.2 SW600.2 SW600.5 U601.5(VIN)
V_BAT_POS: BT600.2(A) C608.1 Q600.2(S) U602.3(VBAT) V_BAT.1
EN: R600.1 U601.4(EN)
PROG: R603.1 U602.5(PROG)
STAT: R604.2 U602.1(STAT)
STAT_R: D601.1(K) R604.1
V_FB: C606.1 R601.2 R602.1 U601.3(FB)
V_SW: D600.2(A) L600.2 U601.1(SW)

Not connected (* = marked no-connect by the designer): SW600 1* 4*

### Notes on the sheet
- Title:
- Size:
- A
- Project
- Rev:
- Sheet:
- of
- College of Engineering
- 1415 Engineering Drive
- Madison, WI 53706
- (in symbol 1043) +
- (in symbol CMP-05427-000061-1) +

### Library data of the parts
BT600 = 1043: Conn Terminal Strip 2 POS Solder Lug ST; pin to pad: 1>N 2>P; Manufacturer 1: Keystone Electronics; Body Material: Nylon; Number of Cells: 1; Supplier: Digi-Key; Supplier Part Number: 36-1043-ND; RoHS: Yes; Category: Passive Components; Stock 1: 3564; Pricing 1: 1=3.00000, 25=2.52400, 100=2.08850, 250=1.92020, 500=1.80144 (USD); Mount: Through Hole,PCB; Number of Pins: 1; Contact Plating: Gold; Material: Nylon; Contact Material: Stainless Steel; Min Operating Temperature: -50°C; Max Operating Temperature: 145°C; Package Quantity: 100; Packaging: Tray; Termination: PC Pin; ComponentLink1URL: https://datasheet.ciiva.com/4/1043-4710.pdf?src-supplier=Digi-Key; ComponentLink1Description: https://datasheet.ciiva.com/4/1043-4710.pdf?src-supplier=Digi-Key; ComponentLink2URL: https://datasheet.ciiva.com/3353/1043-eng-tds-3353208.pdf?src-supplier=Distrelec; ComponentLink2Description: https://datasheet.ciiva.com/3353/1043-eng-tds-3353208.pdf?src-supplier=Distrelec; ComponentLink3URL: https://datasheet.ciiva.com/41803/1043-41803215.pdf?src-supplier=Digi-Key; ComponentLink3Description: https://datasheet.ciiva.com/41803/1043-41803215.pdf?src-supplier=Digi-Key; ComponentLink4URL: https://datasheet.ciiva.com/4642/1043-4642493.pdf?src-supplier=Mouser; ComponentLink4Description: https://datasheet.ciiva.com/4642/1043-4642493.pdf?src-supplier=Mouser; Manufacturer: Keystone Electronics; Manufacturer Part Number: 1043; Stock: 4788; Pricing: 1=2.85, 10=2.62, 25=2.39, 50=2.18, 100=1.97, 500=1.7 (USD); Mounting Technology: Through Hole,PCB; Pins: 1; Series: -; Manufacturer Part Number 1: 1043
C600 = CMP-05427-000061-1: CAP ALUM 100UF 20% 25V SMD; Leakage Current: 3uA; Life (Hours): 2000Hour; Ripple Current: 143mA; Polarity: Polar; Height - Seated (Max): 0.303inch; Contact Plating: Tin; Max Operating Temperature: 85°C; Package Quantity: 900; RoHS Compliant: Yes; Termination: SMD/SMT; Lead Free: Lead Free; Min Operating Temperature: -40°C; Radiation Hardening: No; Length: 8mm; Height: 7.7mm; Series: S; Voltage Rating: 25V; Capacitance: 100uF; Diameter: 6.3mm; Ripple Current (AC): 143mA; Case/Package: Radial; Packaging: Tape and Reel; Voltage: 25V; Tolerance: 20%; Construction: Cylindrical; Voltage Rating (DC): 25V; Mount: Surface Mount
C601-C605 C607 C608 = CMP-2007-03243-2: as C201 on sheet 02_USB_Bridge; Device Class L2: Capacitors; Device Class L1: Passive Components; ComponentLink2URL: https://content.kemet.com/datasheets/KEM_C1006_X5R_SMD.pdf; Height: 1.4mm; Lead Free: Yes; Digikey Description: CAP CER 10UF 10V X5R 0805; Octopart: https://octopart.com/c0805c106k8pactu-kemet-98697; Capacitance: 10uF; Value: 10uF; Temperature Range Low: -55°C; Temperature: -55°C to +85°C; Automotive: No; Mouser Description: CAP CER 10UF 10V X5R 0805; Ipc Land Pattern Name: CAPC200125X125; Temperature Range High: +85°C; Voltage: 10V; RoHS: TRUE; Device Class L3: Ceramic Capacitors; ComponentLink2Description: Datasheet; Voltage Rating: 10V; Package: C0805C-DG; Temperature Characteristic: X5R; Category: Cap
C606 = CMP-1036-03191-3: Part Number: GRM2165C1H182JA01D; Manufacturer: Murata
D600 = CMP-12790-000022-1: DIODE SCHOTTKY 40V 3A SMB; Manufacturer: Diodes Inc.; Max Surge Forward Current: 70A; Value: 180pF; Peak Reverse Current: 2mA; Standoff Height: 0.05mm; Max Junction Temp: +150°C; Device Class L2: Diodes; Octopart: https://octopart.com/b340lb-13-f-diodes+inc.-325823; Device Class L1: Discrete Semiconductors; Forward Current: 3A; Automotive: No; Manufacturer Part Number: B340LB-13-F; Temperature: -55°C to +150°C; Temperature Range Low: -55°C; Max Repetitive Reverse Voltage: 40V; Device Class L3: Schottky Diodes; RoHS: TRUE; Height: 2.5mm; ComponentLink2URL: https://www.diodes.com/assets/Datasheets/ds30240.pdf; Package: SMB; Digikey Description: DIODE SCHOTTKY 40V 3A SMB; Lead Free: Yes; Category: Diode; Reverse Voltage: 40V; Mouser Description: Schottky Diodes & Rectifiers 40V 3A; ComponentLink2Description: Datasheet; Footprint Url: https://www.diodes.com/assets/Package-Files/SMB.pdf; Temperature Range High: +150°C; Capacitance: 180pF
D601 = CMP-1426-00007-2: NexarPartId: 29717780; Wavelength: 520nm; Forward Current: 100mA; Lens Style: Clear, Rectangular; Dominant Wavelength: 525nm; Max Junction Temperature (Tj): 95°C; Power Dissipation: 105mW; Luminous Intensity: 450mcd; Peak Wavelength: 515nm; Color: Green; Viewing Angle: 140°; Test Current: 20mA; Reverse Voltage: 5V; Forward Voltage: 3.2V; Mount: Surface Mount; REACH SVHC: Unknown; Min Operating Temperature: -40°C; Case Code (Imperial): 0805; Case/Package: 0805; Max Operating Temperature: 85°C; RoHS: Compliant; Length: 2mm; Height: 700µm; Width: 1.25mm; Case Code (Metric): 2012; Packaging: Tape and Reel; Max Reverse Voltage (DC): 5V
L600 = CMP-14484-000071-2: SMD Power Inductors 2.2uH ±20% 2.2A 50.4mΩ; Test Frequency: 100kHz; Shielding: Shielded; Core Material: Ferrite; Saturation Current: 3A; Self Resonant Frequency: 60MHz; DC Resistance (DCR): 50.4mR; Height - Seated (Max): 0.071inch; RMS Current (Irms): 2.2A; Min Operating Temperature: -25°C; RoHS Compliant: Yes; Max Operating Temperature: 125°C; Package Quantity: 3500; Halogen Free: Halogen Free; Number of Pins: 2; Packaging: Tape and Reel; Inductance Tolerance: 20%; Lead Pitch: 2.8mm; Width: 0.157inch; Max DC Current: 3A; Tolerance: 20%; Length: 4mm; Resistor Type: Wirewound; Depth: 4.2mm; Current Rating: 2.2A; Lead Free: Lead Free; Series: NRS; Termination: SMD/SMT; Radiation Hardening: No; Mount: Surface Mount; Height: 1.8mm; Inductance: 2.2uH; Case/Package: Nonstandard
Q600 = CMP-2100-03686-1: TOSHIBA Field-Effect Transistor Silicon P-Channel MOS Type (U-MOS VI), 20 V, -55 to 125 degC, 3-Pin SOTFL, RoHS, Tape and Reel; Gate to Source Voltage (Vgs): 8V; Drain to Source Breakdown Voltage: -20V; Turn-Off Delay Time: 107ns; Continuous Drain Current (ID): 6A; Rds On Max: 29.8mOhm; Number of Elements: 1; Turn-On Delay Time: 32ns; Drain to Source Resistance: 47.4mOhm; Drain to Source Voltage (Vdss): 20V; Power Dissipation: 2W; Element Configuration: Single; Max Power Dissipation: 1W; Input Capacitance: 840pF; Manufacturer URL: http://www.toshiba.com/; Number of Pins: 3; Number of Channels: 1; Max Operating Temperature: 150degC; Min Operating Temperature: -55degC; Manufacturer: Toshiba; Mount: SurfaceMount; Package Description: 3-Pin Small Outline Transistor, Flat Lead, Body 2.9 x 1.8 mm, Pitch 0.95 mm; Radiation Hardening: No; Package Quantity: 3000; Package Reference: SOT-23F; RoHSCompliant: true; Package URL: https://toshiba.semicon-storage.com/ap-en/design-support/package/detail.SOT-23F.html; Packaging: TapeandReel; Datasheet Version: 41699.0; Case/Package: SOT-23-3; Datasheet URL: https://toshiba.semicon-storage.com/info/docget.jsp?did=2429&prodName=SSM3J328R
R600 R601 = CMP-1659-00013-4: Chip Resistor, 10 KOhm, +/- 1%, 0.125 W, -55 to 155 degC, 0805 (2012 Metric), RoHS, Tape and Reel; Manufacturer: Yageo; Voltage Rating: 150 V; Mount: Surface Mount; ComponentLink1Description: Manufacturer URL; ComponentLink2URL: http://www.yageo.com/documents/recent/PYu-RC_Group_51_RoHS_L_04.pdf; Pins: 2; Length: 2 mm; Min Operating Temperature: -55 degC; Height: 0.5 mm; Mounting Technology: Surface Mount; RoHSCompliant: true; REACH SVHC: No SVHC; ComponentLink1URL: http://www.yageo.com/; Max Operating Temperature: 155 degC; PackageReference: 0805; DatasheetVersion: Rev. 4, 02/2016; Package Quantity: 5000; Packaging: Tape and Reel; ComponentLink2Description: Datasheet; PackageDescription: 2-Pin Surface Mounted Device, Body 2 x 1.25 mm
R602 = CMP-1013-00675-4: RES 30.0K OHM 1/8W 1% 0805 SMD; Manufacturer: Panasonic; PartNumber: ERJ-6ENF3002V; ComponentLink1URL: http://industrial.panasonic.com/cdbs/www-data/pdf/RDA0000/AOA0000C86.pdf; ComponentLink1Description: Datasheet; PackageReference: 0805
R603 = CMP-2001-00036-1: Part Number: ERJ-6ENF2101V; Manufacturer: Panasonic
R604 = CMP-2001-00628-1: Manufacturer: Panasonic; Part Number: ERA6AEB331V
SW600 = CMP-2000-05087-3: SWITCH SLIDE DPDT 300MA 6V; Switch Function: On-On; Actuator Type: Standard; Switch Travel: 2mm; Actuator Color: Black; Contact Resistance: 70mR; Electrical Life: 5000Cycles; Actuator Material: Nylon; REACH SVHC: No SVHC; Series: JS; Min Operating Temperature: -20°C; Depth: 7.5mm; Housing Material: Nylon; Voltage Rating (DC): 6V; Max Operating Temperature: 85°C; Contact Current Rating: 300mA; Package Quantity: 1; Contact Plating: Silver; Contact Material: Copper Alloy; Throw Configuration: DPDT; Current Rating: 300mA; Orientation: Vertical; Max Current Rating: 300mA; Max Voltage Rating (DC): 6V; Flammability Rating: UL94 V-2; Length: 9mm; Packaging: Tape and Reel; Mount: Surface Mount; Actuator Length: 2mm; Lead Free: Lead Free; Termination: Gull Wing; Radiation Hardening: No
TP600-TP602 V_BAT = CMP-1672-00008-1: as TP400 on sheet 04_PSoC6; ComponentLink1Description: Manufacturer URL; Package Quantity: 1000; DatasheetVersion: 03/2014; Packaging: Tape and Reel; ComponentLink2URL: http://www.keyelco.com/product-pdf.cfm?p=1357; ComponentLink1URL: http://www.keyelco.com/; Mount: Surface Mount; Contact Plating: Silver; PackageDescription: 1-Pin Surface Mount Device, Body 3.81 x 2.03 mm; Pins: 1; RoHSCompliant: True; Mounting Technology: Surface Mount; ComponentLink2Description: Datasheet; PackageReference: 5019
U600 = CMP-0395-00499-2: Single Output LDO, 1 A, Fixed 3.3 V Output, 2 to 5.5 V Input, 4-pin SOT-223 (DCY), -40 to 125 degC, Green (RoHS & no Sb/Br); Manufacturer: Texas Instruments; Vout Adj(Max)(V): 3.3; Iout(Max)(A): 1; SubFamily: Single Channel LDO; Iq(Typ)(mA): 0.05; Accuracy(%): 2; Vin(Max)(V): 5.5; Vdo(Typ)(mV): 1200; PartNumber: TLV1117LV33DCYT; PackageReference: DCY0004A; PackageVersion: 4202506/B; ComponentLink1URL: http://www.ti.com/; DatasheetVersion: SBVS160A; Mounting Technology: Surface Mount; Fixed Output Options(V): 3.3; ComponentLink3Description: Package Specification; PackageDescription: 4-Pin Plastic Small Outline, Body 3.5 x 6.5 mm, Pitch 2.3 mm; Vout Adj(Min)(V): 3.3; ComponentLink2URL: http://www.ti.com/general/docs/lit/getliterature.tsp?genericPartNumber=TLV1117LV33&fileType=pdf; Code_JEDEC: TO-261; ComponentLink1Description: Manufacturer URL; Vin(Min)(V): 2; ComponentLink2Description: Datasheet; Eco-Plan: Green (RoHS & no Sb/Br); ComponentLink3URL: http://www.ti.com/litv/pdf/mpds094a
U601 = CMP-0069-01217-3: 520kHz/1.6MHz - Space-Efficient Boost and SEPIC DC-DC Regulator, 5-pin SOT-23, Pb-Free; Manufacturer: Texas Instruments; PackageTopMarking: SLEB*XTT; PowerWise: N; CompType: Switcher; ComponentLink1URL: http://www.ti.com/general/docs/lit/getliterature.tsp?genericPartNumber=LM2735&fileType=pdf; PackageReference: DBV0005A; PinCount: 5; RoHS: Y; PackageDescription: Molded SOT-23, .115 x .063 x .040 in Body, 5 Lead, .0375 in Pitch; ComponentLink1Description: Datasheet URL
U602 = CMP-0133-00144-2: IC CONTROLLR LI-ION 4.2V SOT23-5; Max Supply Voltage: 6V; Max Output Current: 500mA; Min Output Voltage: 4.168V; Max Output Voltage: 4.232V; Min Supply Voltage: 3.75V; Number of Cells: 1; Lead Free: Lead Free; Number of Pins: 5; Package Quantity: 3000; Min Operating Temperature: -40°C; Width: 1.8mm; Max Charge Current: 500mA; Output Current: 500mA; Packaging: Tape and Reel; Height: 1.3mm; Output Voltage: 4.2V; Max Operating Temperature: 85°C; Mount: Surface Mount; Case/Package: SOT-23; Length: 3.1mm; REACH SVHC: No SVHC

## Sheet 07_Programming_Reset.SchDoc: Programming / Reset
size A; Revision: A; SheetNumber: 7; SheetTotal: 8; ECE315_Project_Name: ECE453 MCU Base Project
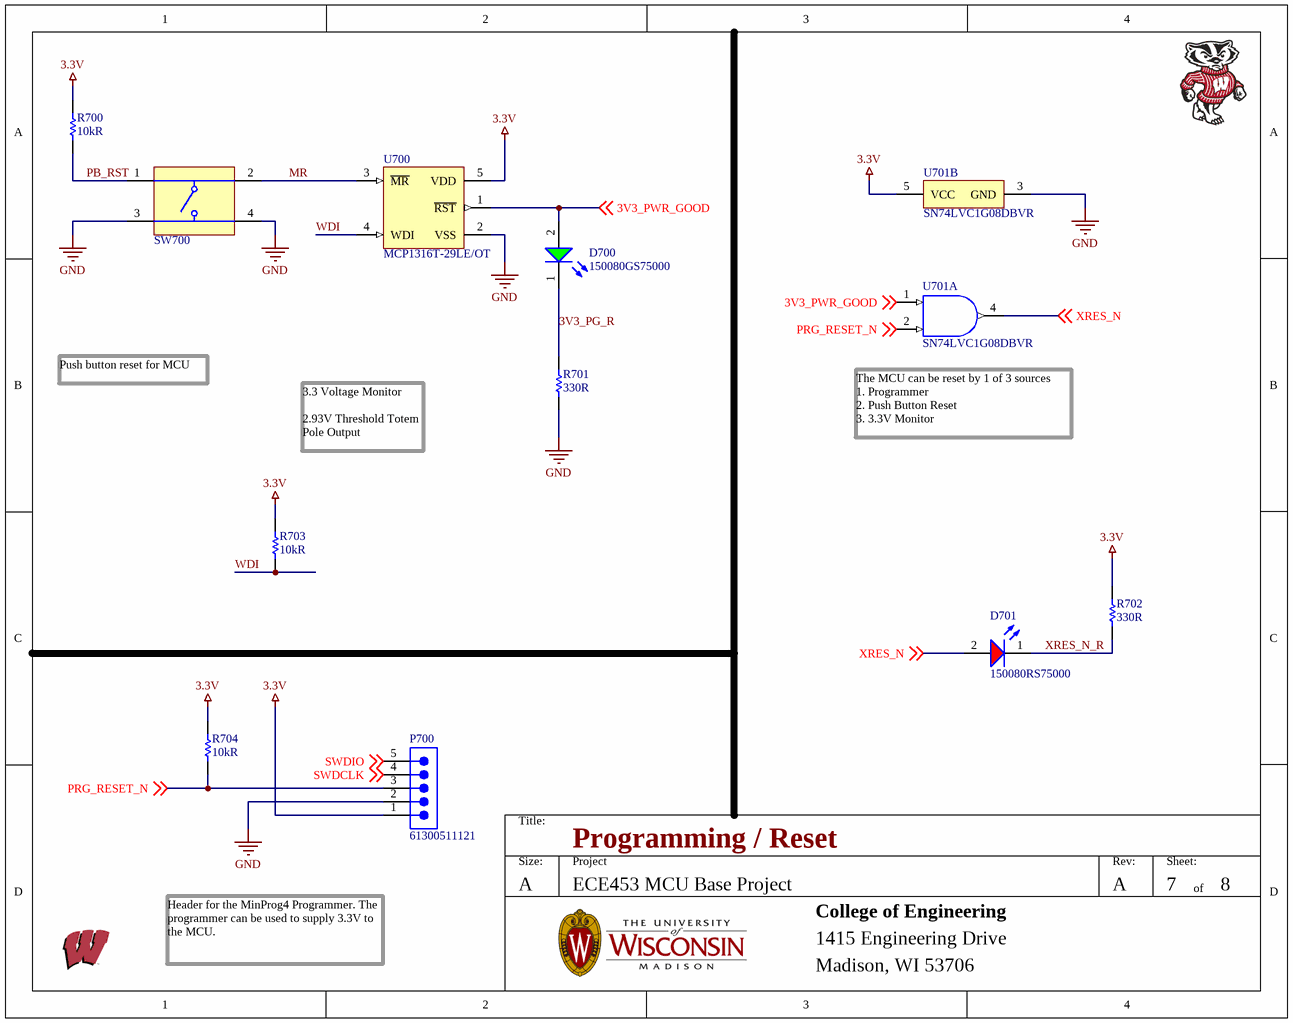
[diagram p6: 07_Programming_Reset.SchDoc]

### Parts
D700  150080GS75000  [WL-SMCW_0805_150080xx75000]
D701  150080RS75000  [WL-SMCW_0805_150080xx75000]
P700  61300511121  [61300511121]
R700  10kR  [RESC2013X70X40ML20T20]
R701  330R  [RESC2013X60X40LL20T25]
R702  330R  [RESC2013X60X40LL20T25]
R703  10kR  [RESC2013X70X40ML20T20]
R704  10kR  [RESC2013X70X40ML20T20]
SW700  (no value)  [TECO-FSM4JSMA_V]
U700  MCP1316T-29LE/OT  [SOT-23-OT5_M]
U701  SN74LVC1G08DBVR  [DBV0005A_M]  (parts A,B of 2)

### Nets
3.3V: P700.1 R700.2 R702.1 R703.2 R704.2 U700.5(VDD) U701.5(VCC)
GND: P700.2 R701.2 SW700.3 SW700.4 U700.2(VSS) U701.3(GND)
3V3_PG_R: D700.1(K) R701.1
3V3_PWR_GOOD: D700.2(A) U700.1(~{RST}) U701.1(A) ; off-sheet 3V3_PWR_GOOD
MR: SW700.2 U700.3(~{MR})
PB_RST: R700.1 SW700.1
PRG_RESET_N: P700.3 R704.1 U701.2(B) ; off-sheet PRG_RESET_N
SWDCLK: P700.4 ; off-sheet SWDCLK
SWDIO: P700.5 ; off-sheet SWDIO
WDI: R703.1 U700.4(WDI)
XRES_N: D701.2(A) U701.4(Y) ; off-sheet XRES_N
XRES_N_R: D701.1(K) R702.2

### Notes on the sheet
- Push button reset for MCU
- (near U701) The MCU can be reset by 1 of 3 sources
  1. Programmer
  2. Push Button Reset
  3. 3.3V Monitor
- 3.3 Voltage Monitor
  2.93V Threshold Totem Pole Output
- Header for the MinProg4 Programmer. The programmer can be used to supply 3.3V to the MCU.
- Title:
- Size:
- A
- Project
- Rev:
- Sheet:
- of
- College of Engineering
- 1415 Engineering Drive
- Madison, WI 53706

### Library data of the parts
D700 = CMP-1426-00007-2: as D601 on sheet 06_Power; Mount: Surface Mount; REACH SVHC: Unknown; Min Operating Temperature: -40°C; Case Code (Imperial): 0805; Case/Package: 0805; Max Operating Temperature: 85°C; RoHS: Compliant; Length: 2mm; Height: 700µm; Width: 1.25mm; Case Code (Metric): 2012; Packaging: Tape and Reel; Max Reverse Voltage (DC): 5V
D701 = CMP-1426-00011-2: NexarPartId: 29717781; Peak Wavelength: 630nm; Wavelength: 625nm; Viewing Angle: 140°; Test Current: 20mA; Forward Voltage: 2V; Forward Current: 100mA; Lens Style: Clear, Rectangular; Color: Red; Luminous Intensity: 150mcd; Max Reverse Voltage (DC): 5V; Length: 2mm; Case Code (Imperial): 0805; RoHS: Compliant; Max Operating Temperature: 85°C; Height: 700µm; Packaging: Tape and Reel; Case/Package: 0805; REACH SVHC: Unknown; Dominant Wavelength: 625nm; Min Operating Temperature: -40°C; Case Code (Metric): 2012; Mount: Surface Mount; Width: 1.25mm
P700 = CMP-1502-01068-2: NexarPartId: 32855526; Operating Supply Voltage: 250V; Number of Contacts: 5; Connector Type: Male Pin; Current Rating: 3A; Contact Resistance: 20mΩ; Pitch: 2.54mm; Gender: Male; Termination: Solder; RoHS: Compliant; Lead Pitch: 2.54mm; Contact Mating Length: 5.9944mm; Number of Positions: 5; Lead Free: Lead Free; Contact Plating: Gold; Number of Pins: 5; Min Operating Temperature: -40°C; Voltage Rating: 250V; Color: Black; Mount: Through Hole; REACH SVHC: Unknown; Packaging: Bulk; Height: 8.89mm; Number of Rows: 1; Orientation: Vertical; Contact Material: Copper; Max Operating Temperature: 105°C
R700 R703 R704 = CMP-2001-04376-1: Manufacturer: Panasonic; Part Number: ERJ-6ENF1002V
R701 R702 = CMP-2001-00628-1: as R604 on sheet 06_Power
SW700 = CMP-2000-05602-2: Swicth, SPST, 24 V, -35 to 85 degC, 4-Pin SMD, RoHS, Tape and Reel; Manufacturer: TE Connectivity; Switch Travel: 0.25mm; Mechanical Life: 100000Cycles; Contact Current Rating: 50mA; Operating Force: 1.57N; Actuator Material: Polyamide; Contact Resistance: 100mOhm; Voltage Rating: 24V; Illumination Type: Illuminated; Actuator Length: 0.055inch; Max Voltage Rating (DC): 12V; Case\/Package: SMD/SMT; Orientation: Straight; Datasheet URL: http://www.te.com/commerce/DocumentDelivery/DDEController?Action=showdoc&DocId=Customer+Drawing%7F2-1437565-7%7FV%7Fpdf%7FEnglish%7FENG_CD_2-1437565-7_V.pdf%7F4-1437565-2; Min Operating Temperature: -35degC; Packaging: LoosePiece; Termination: GullWing; Throw Configuration: SPST; Package Description: 4-Pin Surface Mount Device, Body 6 x 6 mm, Pitch 4.5 mm; Mounting Technology: SurfaceMount; Contact Plating: Silver; Datasheet Version: Rev. V, 02/2015; RoHSCompliant: true; Max Operating Temperature: 85degC; Length: 6mm; Voltage Rating (DC): 24V; Electrical Life: 100000Cycles; Current Rating: 50mA; Package Quantity: 750; Mount: SurfaceMount; Package Reference: FSM4JSMA; Manufacturer URL: http://www.te.com/; Width: 6mm; REACH SVHC: Unknown; Contact Material: CopperAlloy
U700 = CMP-0138-00207-1: Voltage Supervisor, 5-Pin SOT-23, Extended Temperature, Tape and Reel; PackageReference: SOT-23-OT5; Code_IPC: SOT23-5; DatasheetVersion: revB, Oct-2007; PackageDescription: 5-Lead Plastic Small Outline Transistor (OT) [SOT-23]; PackageVersion: revBB, Aug-2009
U701 = CMP-0859-00053-3: Single 2-Input Positive-AND Gate, DBV0005A, LARGE T&R; Manufacturer: Texas Instruments; Logic: True; ICC @ Nom Voltage(Max)(mA): 0.01; VCC(Min)(V): 1.65; Bits(#): 1; Rating: Catalog; Schmitt Trigger: No; Voltage(Nom)(V): 1.8,2.5,3.3,5; Output Drive (IOL/IOH)(Max)(mA): 32/-32; Gate Type: AND; tpd @ Nom Voltage(Max)(ns): 4.5,6,4,5; VCC(Max)(V): 5.5; Output Type: CMOS; F @ Nom Voltage(Max)(Mhz): 150; Input Type: CMOS/TTL; Technology Family: LVC; Sub-Family: AND Gate; PackageReference: DBV0005A; Generic Part Number: SN74LVC1G08; Operating Temperature Range(C): -40 to 125,-40 to 85; 3-State Output: No; DatasheetVersion: SCES217Y